# Altium schematic sheet DM2097_Connector_B.SchDoc: =project_title
size Tabloid; CompanyName: Luxonis Holding; Organization: Luxonis Holding; Address1: 1925 Harmony Park Drive; Address2: Westminster, CO; Address3: 80234; Address4: United States; SheetNumber: 3; SheetTotal: 17
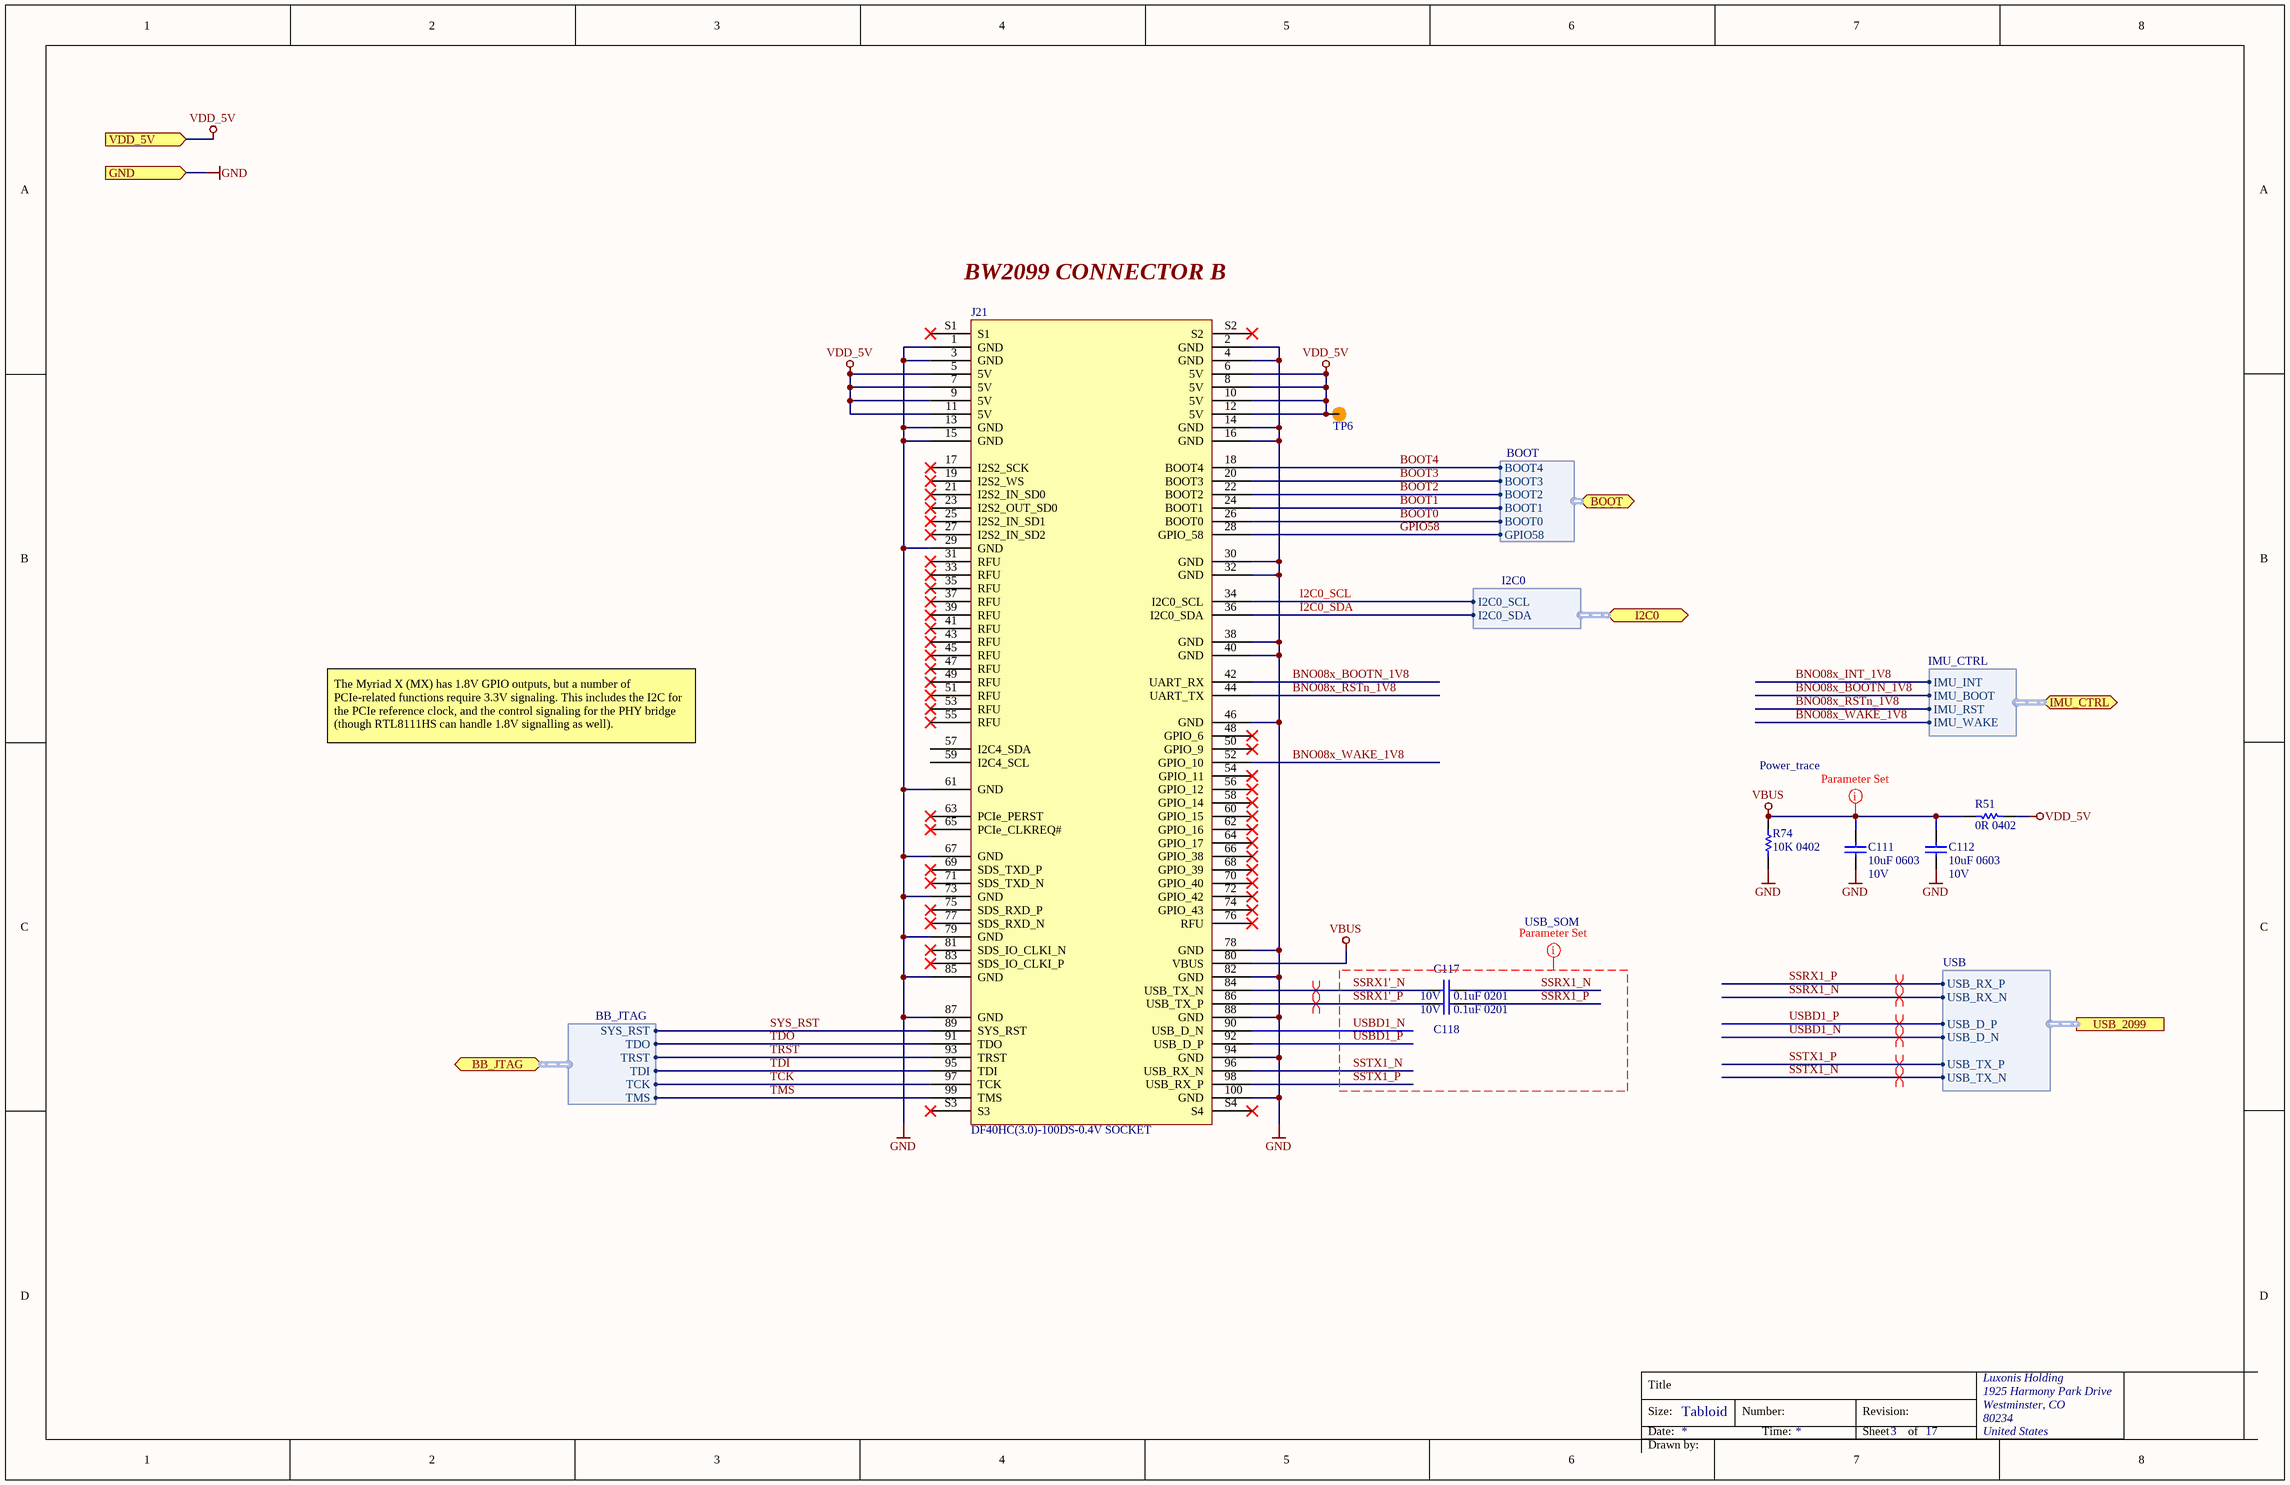
[diagram p0: DM2097_Connector_B.SchDoc]

## Parts
C111  10uF 0603  Voltage Rating: 10V  [CAPC0603(1608)100_N]
C112  10uF 0603  Voltage Rating: 10V  [CAPC0603(1608)100_N]
C117  0.1uF 0201  Voltage: 10V  [CAPC0201(0603)33_L]
C118  0.1uF 0201  Voltage: 10V  [CAPC0201(0603)33_L]
J21  DF40HC(3.0)-100DS-0.4V SOCKET  [DF40HC-3.0-100DS-0.4V_minpad]
R51  0R 0402  [RESC0402(1005)_N]
R74  10K 0402  [RESC0402(1005)_N]
TP6  TP100_200_NS  [TP100_200_NS]  (value not drawn)  (no BOM)

## Ports
BB_JTAG (bidir, harness BB_JTAG), BOOT (bidir, harness BOOT), GND (in), I2C0 (bidir, harness I2C0), IMU_CTRL (bidir, harness IMU_CTRL), USB_2099 (harness USB), VDD_5V (in)

## Harnesses
BB_JTAG: SYS_RST, TDO, TRST, TDI, TCK, TMS
BOOT: BOOT4, BOOT3, BOOT2, BOOT1, BOOT0, GPIO58
USB: USB_D_P, USB_D_N, USB_TX_N, USB_TX_P, USB_RX_N, USB_RX_P
IMU_CTRL: IMU_BOOT, IMU_RST, IMU_INT, IMU_WAKE
I2C0: I2C0_SCL, I2C0_SDA

## Nets
GND: C111.1 C112.1 J21.1(GND) J21.2(GND) J21.3(GND) J21.4(GND) J21.13(GND) J21.14(GND) J21.15(GND) J21.16(GND) J21.29(GND) J21.30(GND) J21.32(GND) J21.38(GND) J21.40(GND) J21.46(GND) J21.61(GND) J21.67(GND) J21.73(GND) J21.78(GND) J21.79(GND) J21.82(GND) J21.85(GND) J21.87(GND) J21.88(GND) J21.94(GND) J21.100(GND) R74.1 ; port GND
VBUS: C111.2 C112.2 J21.80(VBUS) R51.1 R74.2
VDD_5V: J21.5(5V) J21.6(5V) J21.7(5V) J21.8(5V) J21.9(5V) J21.10(5V) J21.11(5V) J21.12(5V) R51.2 TP6.1 ; port VDD_5V
BNO08x_BOOTN_1V8: J21.42(UART_RX) ; port IMU_CTRL.IMU_BOOT
BNO08x_INT_1V8: port IMU_CTRL.IMU_INT
BNO08x_RSTn_1V8: J21.44(UART_TX) ; port IMU_CTRL.IMU_RST
BNO08x_WAKE_1V8: J21.52(GPIO_10) ; port IMU_CTRL.IMU_WAKE
BOOT0: J21.26(BOOT0) ; port BOOT.BOOT0
BOOT1: J21.24(BOOT1) ; port BOOT.BOOT1
BOOT2: J21.22(BOOT2) ; port BOOT.BOOT2
BOOT3: J21.20(BOOT3) ; port BOOT.BOOT3
BOOT4: J21.18(BOOT4) ; port BOOT.BOOT4
GPIO58: J21.28(GPIO_58) ; port BOOT.GPIO58
I2C0_SCL: J21.34(I2C0_SCL) ; port I2C0.I2C0_SCL
I2C0_SDA: J21.36(I2C0_SDA) ; port I2C0.I2C0_SDA
SSRX1'_N: C117.1 J21.84(USB_TX_N)
SSRX1'_P: C118.1 J21.86(USB_TX_P)
SSRX1_N: C117.2 ; port USB_2099.USB_RX_N
SSRX1_P: C118.2 ; port USB_2099.USB_RX_P
SSTX1_N: J21.96(USB_RX_N) ; port USB_2099.USB_TX_N
SSTX1_P: J21.98(USB_RX_P) ; port USB_2099.USB_TX_P
SYS_RST: J21.89(SYS_RST) ; port BB_JTAG.SYS_RST
TCK: J21.97(TCK) ; port BB_JTAG.TCK
TDI: J21.95(TDI) ; port BB_JTAG.TDI
TDO: J21.91(TDO) ; port BB_JTAG.TDO
TMS: J21.99(TMS) ; port BB_JTAG.TMS
TRST: J21.93(TRST) ; port BB_JTAG.TRST
USBD1_N: J21.90(USB_D_N) ; port USB_2099.USB_D_N
USBD1_P: J21.92(USB_D_P) ; port USB_2099.USB_D_P

Not connected (* = marked no-connect by the designer): J21 17(I2S2_SCK)* 19(I2S2_WS)* 21(I2S2_IN_SD0)* 23(I2S2_OUT_SD0)* 25(I2S2_IN_SD1)* 27(I2S2_IN_SD2)* 31(RFU)* 33(RFU)* 35(RFU)* 37(RFU)* 39(RFU)* 41(RFU)* 43(RFU)* 45(RFU)* 47(RFU)* 48(GPIO_6)* 49(RFU)* 50(GPIO_9)* 51(RFU)* 53(RFU)* 54(GPIO_11)* 55(RFU)* 56(GPIO_12)* 57(I2C4_SDA) 58(GPIO_14)* 59(I2C4_SCL) 60(GPIO_15)* 62(GPIO_16)* 63(PCIe_PERST)* 64(GPIO_17)* 65(PCIe_CLKREQ#)* 66(GPIO_38)* 68(GPIO_39)* 69(SDS_TXD_P)* 70(GPIO_40)* 71(SDS_TXD_N)* 72(GPIO_42)* 74(GPIO_43)* 75(SDS_RXD_P)* 76(RFU)* 77(SDS_RXD_N)* 81(SDS_IO_CLKI_N)* 83(SDS_IO_CLKI_P)* S1* S2* S3* S4*

## Layout directives
differential pair; differential pair class 90ohm: SSRX1'_N, SSRX1'_P, SSRX1_N, SSRX1_P, SSTX1_N, SSTX1_P, USBD1_N, USBD1_P
net class Power_trace: VBUS
net class USB_SOM: SSRX1'_N, SSRX1'_P, SSRX1_N, SSRX1_P, SSTX1_N, SSTX1_P, USBD1_N, USBD1_P

## Notes on the sheet
- (near J21) BW2099 CONNECTOR B
- The Myriad X (MX) has 1.8V GPIO outputs, but a number of PCIe-related functions require 3.3V signaling. This includes the I2C for the PCIe reference clock, and the control signaling for the PHY bridge (though RTL8111HS can handle 1.8V signalling as well).
- Title
- Size:
- Date:
- Tabloid
- Number:
- Time:
- Revision:
- Sheet
- of
- Drawn by:

## Library data of the parts
C111 C112 = GRM188R61A106ME69D: CAP CER 10UF 10V X5R 0603 20%; Manufacturer 1: Murata; Material: Ceramic; Manufacturer Part Number 1: GRM188R61A106ME69D; Supplier 1: Digi-Key; Stock 1: 2873098; Pricing 1: 1=0.21000, 10=0.14100, 100=0.07130, 500=0.04876, 1000=0.04313 (USD); RoHS: Yes; Mount: Surface Mount; Case/Package: 0603; Case Code (Metric): 1608; Case Code (Imperial): 0603; Min Operating Temperature: -55°C; Max Operating Temperature: 85°C; Packaging: Tape and Reel; Capacitance: 10uF; Dielectric: X5R; Length: 1.6mm; Width: 0.8mm; ComponentLink1URL: http://www.mouser.com/ds/2/281/c02e-2905.pdf?src-supplier=Mouser; ComponentLink1Description: http://www.mouser.com/ds/2/281/c02e-2905.pdf?src-supplier=Mouser; Supplier Part Number 1: 490-10475-1-ND; Voltage Rating (DC): 10V; Thickness: 0.035inch; Tolerance: 20%; Weight: 0.000222oz; Package Quantity: 4000; Termination: SMD/SMT; Height: 0.8mm; Depth: 0.8mm; REACH SVHC: Unknown; Lead Free: Lead Free; ComponentLink2URL: http://components.arrow.com/part/dataview/0323_06119472?src-supplier=Arrow+Europe; ComponentLink2Description: http://components.arrow.com/part/dataview/0323_06119472?src-supplier=Arrow+Europe; ComponentLink3URL: http://www.farnell.com/datasheets/2048014.pdf?src-supplier=Farnell; ComponentLink3Description: http://www.farnell.com/datasheets/2048014.pdf?src-supplier=Farnell; ComponentLink4URL: http://www.farnell.com/datasheets/1872210.pdf?src-supplier=Farnell; ComponentLink4Description: http://www.farnell.com/datasheets/1872210.pdf?src-supplier=Farnell; ComponentLink5URL: http://search.murata.co.jp/Ceramy/image/img/A01X/G101/ENG/GRM188R61A106ME69-01.pdf?src-supplier=Digi-Key; ComponentLink5Description: http://search.murata.co.jp/Ceramy/image/img/A01X/G101/ENG/GRM188R61A106ME69-01.pdf?src-supplier=Digi-Key; ComponentLink6URL: http://www.farnell.com/datasheets/1872210.pdf?src-supplier=Newark; ComponentLink6Description: http://www.farnell.com/datasheets/1872210.pdf?src-supplier=Newark; ComponentLink7URL: http://www.farnell.com/datasheets/2048014.pdf?src-supplier=Element14; ComponentLink7Description: http://www.farnell.com/datasheets/2048014.pdf?src-supplier=Element14; ComponentLink8URL: http://www.farnell.com/datasheets/2048014.pdf?src-supplier=Newark; ComponentLink8Description: http://www.farnell.com/datasheets/2048014.pdf?src-supplier=Newark
C117 C118 = GRM033R61A104KE15D: CAP CER 0.1UF 10V X5R 0201; Manufacturer 1: Murata; Capacitance: 100nF; Tolerance: 10%; Supplier 1: Digi-Key; Manufacturer Part Number 1: GRM033R61A104KE15D; Stock 1: 45335312; Pricing 1: 1=0.10000, 10=0.04200, 100=0.01860, 500=0.01330, 1000=0.01045, 2500=0.00950, 5000=0.00874 (USD); RoHS: Yes; Mount: Surface Mount; Case/Package: 0201; Weight: 6E-06oz; Case Code (Metric): 0603; Case Code (Imperial): 0201; Min Operating Temperature: -55°C; Max Operating Temperature: 85°C; Packaging: Tape and Reel; Voltage Rating: 10V; Package Quantity: 1; Voltage Rating (DC): 10V; Dielectric: X5R; Termination: SMD/SMT; Length: 0.6mm; Height: 0.3mm; Width: 0.012inch; Thickness: 0.013inch; Depth: 0.3mm; Radiation Hardening: No; Lead Free: Lead Free; REACH SVHC: No SVHC; ComponentLink1URL: https://datasheet.ciiva.com/26843/getdatasheetpartid-308656-26843739.pdf?src-supplier=Verical; ComponentLink1Description: https://datasheet.ciiva.com/26843/getdatasheetpartid-308656-26843739.pdf?src-supplier=Verical; ComponentLink2URL: https://datasheet.ciiva.com/5413/product-5413117.pdf?src-supplier=Mouser; ComponentLink2Description: https://datasheet.ciiva.com/5413/product-5413117.pdf?src-supplier=Mouser; ComponentLink3URL: https://datasheet.ciiva.com/6256/partnumbering-e-01-6256406.pdf?src-supplier=Digi-Key; ComponentLink3Description: https://datasheet.ciiva.com/6256/partnumbering-e-01-6256406.pdf?src-supplier=Digi-Key; ComponentLink4URL: https://datasheet.ciiva.com/6256/partnumbering-e-01-6256407.pdf?src-supplier=Digi-Key; ComponentLink4Description: https://datasheet.ciiva.com/6256/partnumbering-e-01-6256407.pdf?src-supplier=Digi-Key; ComponentLink5URL: https://datasheet.ciiva.com/6256/partnumbering-e-01-6256408.pdf?src-supplier=Digi-Key; ComponentLink5Description: https://datasheet.ciiva.com/6256/partnumbering-e-01-6256408.pdf?src-supplier=Digi-Key; Supplier Part Number 1: 490-5881-1-ND
J21 = BW2099_SCKT_Conn_B: Conn Board to Board RCP 100 POS 0.4mm Solder ST SMD T/R; Manufacturer 1: Hirose; Manufacturer Part Number 1: DF40HC(3.0)-100DS-0.4V(51; Connector Type: Receptacle; Number of Positions: 100; Pitch: 0.016inch; Supplier 1: Mouser; RoHS: Yes; Category: Headers and Wire Housings; Stock 1: 4724; Pricing 1: 1=2.50000, 10=2.15000, 50=2.15000, 100=2.00000, 1000=1.45000, 10000=1.29000 (USD); Mount: Surface Mount; Contact Plating: Gold; Package Quantity: 3000; Packaging: Tape and Reel; Number of Rows: 2; ComponentLink1URL: https://datasheet.ciiva.com/13559/ed-df40-20140305-13559540.pdf?src-supplier=Mouser; ComponentLink1Description: https://datasheet.ciiva.com/13559/ed-df40-20140305-13559540.pdf?src-supplier=Mouser; ComponentLink2URL: https://datasheet.ciiva.com/18562/ed-df40-20140305-18562462.pdf?src-supplier=Digi-Key; ComponentLink2Description: https://datasheet.ciiva.com/18562/ed-df40-20140305-18562462.pdf?src-supplier=Digi-Key
R51 = CRCW04020000Z0ED: RES SMD 0 OHM JUMPER 1/16W 0402; Manufacturer 1: Vishay; Resistance: 0mR; Power Rating: 63mW; Voltage Rating: 50V; Temperature Coefficient: 100ppm/°C; Tolerance: 5%; Manufacturer Part Number 1: CRCW04020000Z0ED; Supplier 1: Digi-Key; Stock 1: 855968; Pricing 1: 1=0.10000, 10=0.03400, 25=0.02440, 50=0.01860, 100=0.01380, 250=0.01048, 500=0.00840, 1000=0.00618, 5000=0.00443 (USD); RoHS: Yes; Mount: Surface Mount; Case/Package: 0402; Weight: 2.3E-05oz; Case Code (Imperial): 0402; Case Code (Metric): 1005; Contact Plating: Tin; Min Operating Temperature: -55°C; Max Operating Temperature: 155°C; Packaging: Tape and Reel; Composition: Thick Film; Voltage Rating (DC): 50V; Package Quantity: 1; Termination: SMD/SMT; Number of Terminations: 2; Military Standard: Not; Max Power Dissipation: 63mW; Features: Automotive AEC-Q200; Length: 1mm; Height: 0.35mm; Width: 0.5mm; Depth: 0.5mm; Radiation Hardening: No; REACH SVHC: Unknown; Lead Free: Lead Free; ComponentLink1URL: https://datasheet.ciiva.com/3255/dcrcwe3-3255944.pdf?src-supplier=Avnet; ComponentLink1Description: https://datasheet.ciiva.com/3255/dcrcwe3-3255944.pdf?src-supplier=Avnet; ComponentLink2URL: https://datasheet.ciiva.com/3255/dcrcwe3-3255945.pdf?src-supplier=Avnet; ComponentLink2Description: https://datasheet.ciiva.com/3255/dcrcwe3-3255945.pdf?src-supplier=Avnet; ComponentLink3URL: https://datasheet.ciiva.com/16881/dcrcwe3-16881413.pdf?src-supplier=Avnet+Europe; ComponentLink3Description: https://datasheet.ciiva.com/16881/dcrcwe3-16881413.pdf?src-supplier=Avnet+Europe; ComponentLink4URL: https://datasheet.ciiva.com/2461/dcrcwe3-2461962.pdf?src-supplier=Digi-Key; ComponentLink4Description: https://datasheet.ciiva.com/2461/dcrcwe3-2461962.pdf?src-supplier=Digi-Key; ComponentLink5URL: https://datasheet.ciiva.com/7841/1720486-7841802.pdf?src-supplier=Element14; ComponentLink5Description: https://datasheet.ciiva.com/7841/1720486-7841802.pdf?src-supplier=Element14; ComponentLink6URL: https://datasheet.ciiva.com/2461/dcrcwe3-2461963.pdf?src-supplier=Digi-Key; ComponentLink6Description: https://datasheet.ciiva.com/2461/dcrcwe3-2461963.pdf?src-supplier=Digi-Key; ComponentLink7URL: https://datasheet.ciiva.com/2461/dcrcwe3-2461964.pdf?src-supplier=Digi-Key; ComponentLink7Description: https://datasheet.ciiva.com/2461/dcrcwe3-2461964.pdf?src-supplier=Digi-Key; ComponentLink8URL: https://datasheet.ciiva.com/7841/1697337-7841468.pdf?src-supplier=Element14; ComponentLink8Description: https://datasheet.ciiva.com/7841/1697337-7841468.pdf?src-supplier=Element14; ComponentLink9URL: https://datasheet.ciiva.com/16761/70200976-16761309.pdf?src-supplier=Allied+Electronics; ComponentLink9Description: https://datasheet.ciiva.com/16761/70200976-16761309.pdf?src-supplier=Allied+Electronics; ComponentLink10URL: https://datasheet.ciiva.com/26311/fld-crcw-e3-data-en-26311550.pdf?src-supplier=Distrelec; ComponentLink10Description: https://datasheet.ciiva.com/26311/fld-crcw-e3-data-en-26311550.pdf?src-supplier=Distrelec; Supplier Part Number 1: 541-0.0JCT-ND
R74 = RC0402FR-1310KL: RES SMD 10K OHM 1% 0402 1/16W Chip Resistor, 0402 [1005 Metric], 10 kohm, RC Series, 50 V, Thick Film, 62.5 mW; Manufacturer 1: Yageo; Resistance: 10kR; Temperature Coefficient: 100ppm/°C; Power Rating: 62.5mW; Voltage Rating: 50V; Manufacturer Part Number 1: RC0402FR-1310KL; ComponentLink1URL: https://datasheet.ciiva.com/16940/pyu-rc0402-51-rohs-l-6-16940293.pdf?src-supplier=Avnet+Europe; ComponentLink1Description: https://datasheet.ciiva.com/16940/pyu-rc0402-51-rohs-l-6-16940293.pdf?src-supplier=Avnet+Europe; ComponentLink2URL: https://datasheet.ciiva.com/28386/pyu-rc0402-51-rohs-l-6-28386855.pdf?src-supplier=Avnet+Europe; ComponentLink2Description: https://datasheet.ciiva.com/28386/pyu-rc0402-51-rohs-l-6-28386855.pdf?src-supplier=Avnet+Europe; ComponentLink3URL: https://datasheet.ciiva.com/16740/pyu-rc0402-51-rohs-l-6-r-16740602.pdf?src-supplier=Future+Electronics; ComponentLink3Description: https://datasheet.ciiva.com/16740/pyu-rc0402-51-rohs-l-6-r-16740602.pdf?src-supplier=Future+Electronics; ComponentLink4URL: https://datasheet.ciiva.com/8891/pyu-rc0402-51-rohs-l-6-8891339.pdf?src-supplier=Avnet; ComponentLink4Description: https://datasheet.ciiva.com/8891/pyu-rc0402-51-rohs-l-6-8891339.pdf?src-supplier=Avnet; ComponentLink5URL: https://datasheet.ciiva.com/5557/pyu-rc0402-51-rohs-l-6-r-5557997.pdf?src-supplier=Mouser; ComponentLink5Description: https://datasheet.ciiva.com/5557/pyu-rc0402-51-rohs-l-6-r-5557997.pdf?src-supplier=Mouser; ComponentLink6URL: https://datasheet.ciiva.com/7983/1018594-7983533.pdf?src-supplier=Element14; ComponentLink6Description: https://datasheet.ciiva.com/7983/1018594-7983533.pdf?src-supplier=Element14; Supplier 1: Newark; Stock 1: 62239; Pricing 1: 1=0.10000, 25=0.01200, 100=0.00400, 250=0.00400, 500=0.00300, 1000=0.00300 (USD); RoHS: Yes; Case/Package: 0402; Number of Pins: 2; Contact Plating: Tin,Matte,Lead; Case Code (Imperial): 0402; Case Code (Metric): 1005; Min Operating Temperature: -55°C; Max Operating Temperature: 155°C; Tolerance: 1%; Composition: Thick Film; Packaging: Tape and Reel; Termination: SMD/SMT; Military Standard: Not; Voltage Rating (DC): 50V; Working Voltage: 50V; Number of Terminations: 2; Length: 1mm; Depth: 0.5mm; Radiation Hardening: No; REACH SVHC: No SVHC; Lead Free: Lead Free; Supplier Part Number 1: 67R9960; Supplier 2: Future Electronics; Supplier 3: Mouser; Supplier 4: Element14; Supplier Part Number 2: RC0402FR-1310KL-CUTT; Supplier Part Number 3: 603-RC0402FR-1310KL; Supplier Part Number 4: 1799235
TP6 = TEST_POINT